# EAGLE design Adafruit PowerBoost 1000C (EAGLE 9.3.0)
COMPANY: ADAFRUIT INDUSTRIES; DRAWN: KTOWN; REV: A
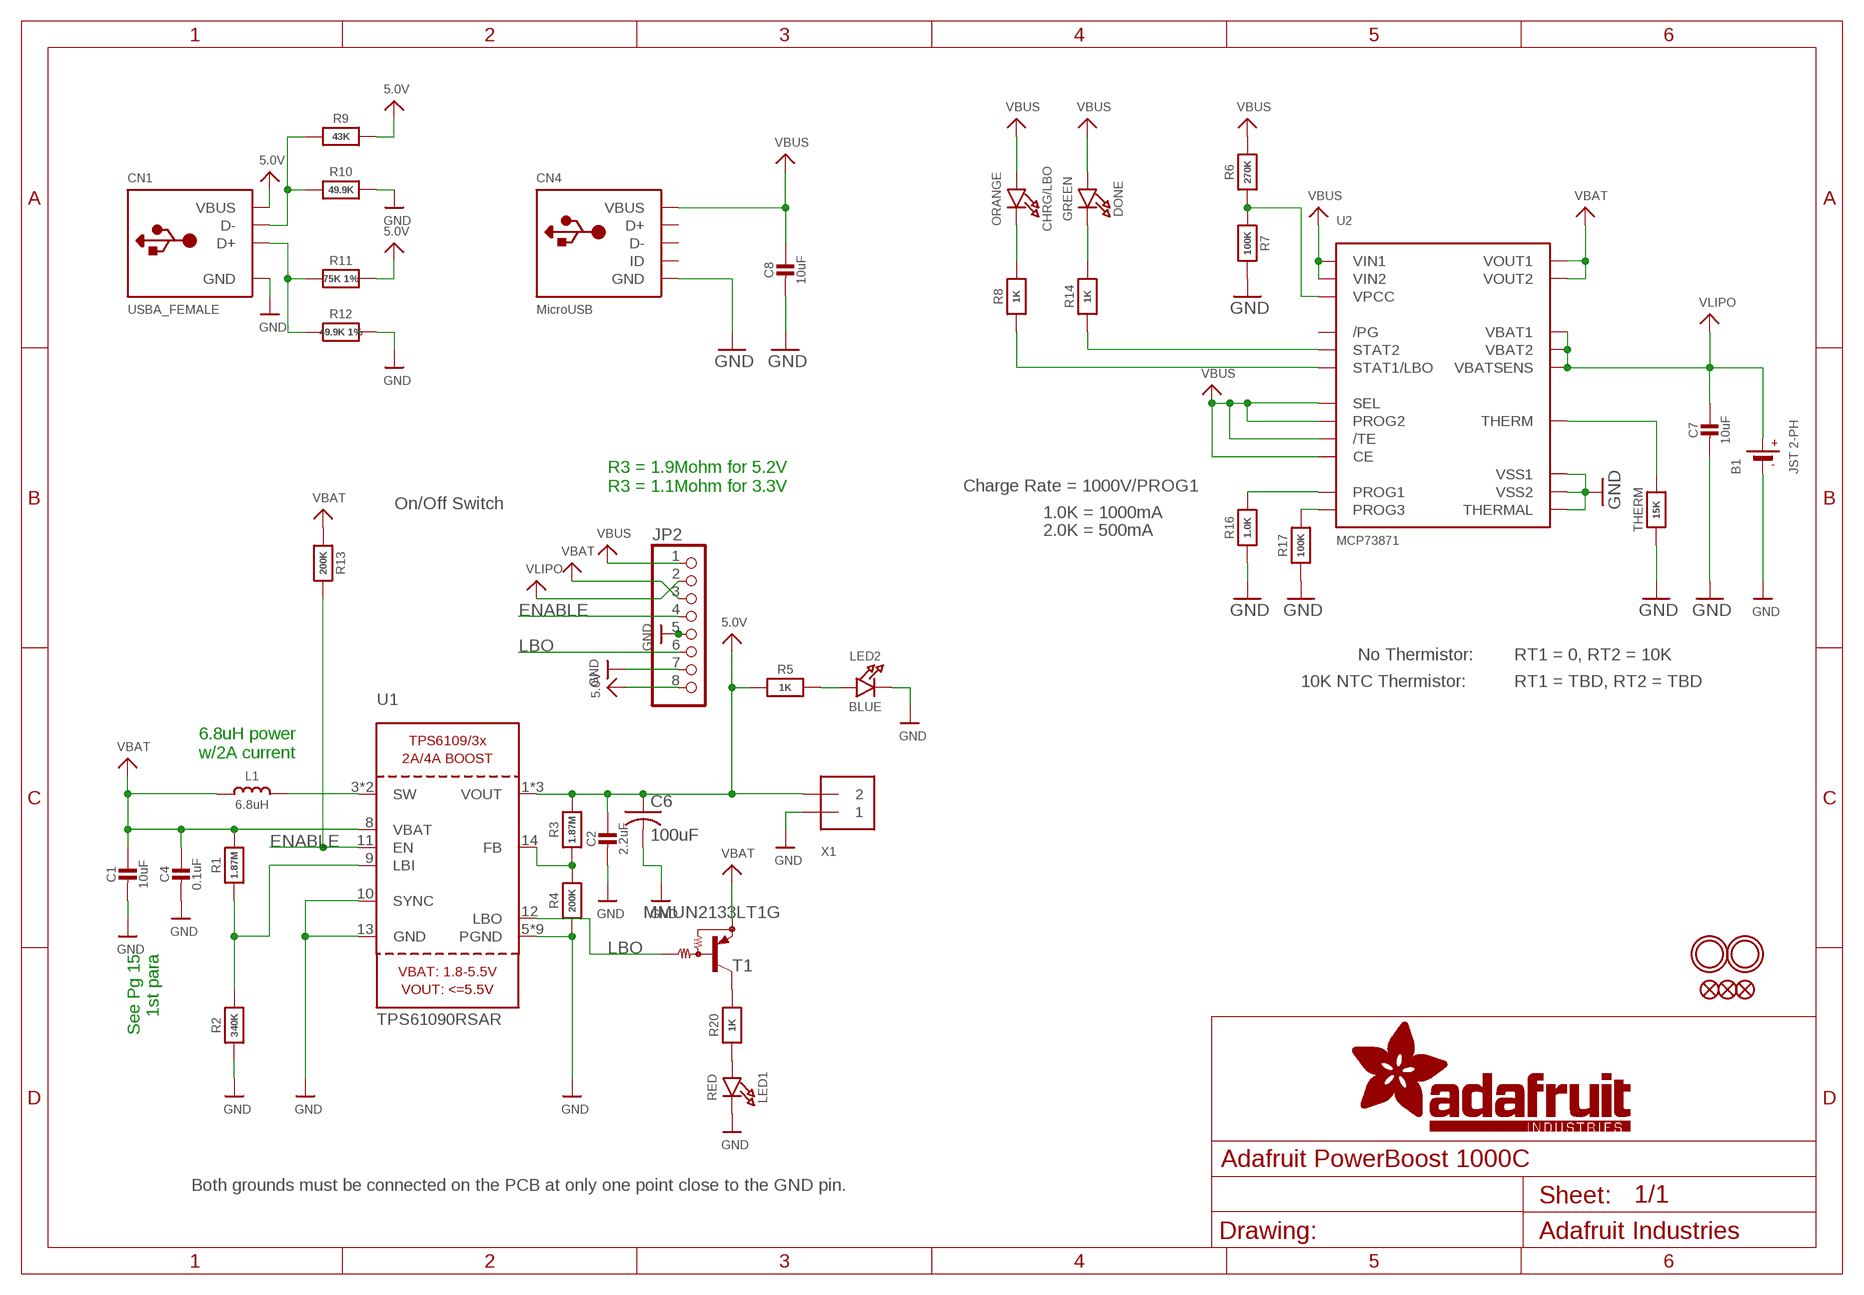
[diagram p0: schematic, sheet 1]

## Parts
B1  JST 2-PH  BATTERY  [JSTPH2]
C1  10uF  CAP_CERAMIC0805-NOOUTLINE  [0805-NO]
C2  2.2uF  CAP_CERAMIC0805-NOOUTLINE  [0805-NO]
C4  0.1uF  CAP_CERAMIC0805_10MGAP  [0805_10MGAP]
C6  100uF  C-USC1210  [C1210]
C7  10uF  CAP_CERAMIC0805-NOOUTLINE  [0805-NO]
C8  10uF  CAP_CERAMIC0805-NOOUTLINE  [0805-NO]
CHRG/LBO  ORANGE  LED0805_NOOUTLINE  [CHIPLED_0805_NOOUTLINE]
CN1  USBA_FEMALE  USB_TYPEAPTHFML  [USB_HOST-PTH]
CN4  MicroUSB  USBMICRO_20329  [4UCONN_20329]
DONE  GREEN  LED0805_NOOUTLINE  [CHIPLED_0805_NOOUTLINE]
FID1  FIDUCIAL""  [FIDUCIAL_1MM]
FID2  FIDUCIAL""  [FIDUCIAL_1MM]
FID3  FIDUCIAL""  [FIDUCIAL_1MM]
JP2  HEADER-1X8ROUND  [1X08_ROUND]
L1  6.8uH  INDUCTORTDK_VLC5045  [INDUCTOR_5X5MM_TDK_VLC5045]
LED1  RED  LED0805_NOOUTLINE  [CHIPLED_0805_NOOUTLINE]
LED2  BLUE  LED0805_NOOUTLINE  [CHIPLED_0805_NOOUTLINE]
R1  1.87M  RESISTOR_0805MP  [_0805MP]
R2  340K  RESISTOR_0805MP  [_0805MP]
R3  1.87M  RESISTOR0805_NOOUTLINE  [0805-NO]
R4  200K  RESISTOR0805_NOOUTLINE  [0805-NO]
R5  1K  RESISTOR0805_NOOUTLINE  [0805-NO]
R6  270K  RESISTOR0805_NOOUTLINE  [0805-NO]
R7  100K  RESISTOR0805_NOOUTLINE  [0805-NO]
R8  1K  RESISTOR0805_NOOUTLINE  [0805-NO]
R9  43K  RESISTOR0805_NOOUTLINE  [0805-NO]
R10  49.9K  RESISTOR0805_NOOUTLINE  [0805-NO]
R11  75K 1%  RESISTOR0805_NOOUTLINE  [0805-NO]
R12  49.9K 1%  RESISTOR0805_NOOUTLINE  [0805-NO]
R13  200K  RESISTOR0805_NOOUTLINE  [0805-NO]
R14  1K  RESISTOR0805_NOOUTLINE  [0805-NO]
R16  1.0K  RESISTOR0805_NOOUTLINE  [0805-NO]
R17  100K  RESISTOR0805_NOOUTLINE  [0805-NO]
R20  1K  RESISTOR0805_NOOUTLINE  [0805-NO]
T1  MMUN2133LT1G  MUN2114T1-PNP_DRIVER-SC59-BEC  [SC59-BEC]
THERM  15K  RESISTOR0805_NOOUTLINE  [0805-NO]
U1  TPS61090RSAR  VREG_TPS6103X  [PVQFN-16]
U2  MCP73871  [QFN20_4MM]
U$10  MOUNTINGHOLE2.5  [MOUNTINGHOLE_2.5_PLATED]
U$11  MOUNTINGHOLE2.5  [MOUNTINGHOLE_2.5_PLATED]
X1  TERMBLOCK_1X2  [TERMBLOCK_1X2-3.5MM]

## Nets
5.0V: C2.1 C6.1 CN1.VBUS JP2.8 R3.2 R5.1 R9.2 R11.2 U1.1(VOUT) U1.15(VOUT) U1.16(VOUT) X1.2
D+: CN1.D+ R11.1 R12.1
D-: CN1.D- R9.1 R10.1
ENABLE: JP2.4 R13.2 U1.11(EN)
GND: B1.1(-) C1.2 C2.2 C4.2 C6.2 C7.2 C8.2 CN1.GND CN4.BASE@1(GND) CN4.BASE@2(GND) CN4.GND CN4.SPRT@1(GND) CN4.SPRT@2(GND) CN4.SPRT@3(GND) CN4.SPRT@4(GND) JP2.5 JP2.7 LED1.C LED2.C R2.1 R4.1 R7.2 R10.2 R12.2 R16.1 R17.1 THERM.1 U1.5(PGND) U1.6(PGND) U1.7(PGND) U1.10(SYNC) U1.13(GND) U1.P$18(PGND) U1.P$19(PGND) U1.P$20(PGND) U1.P$21(PGND) U1.P$22(PGND) U1.THERMAL(PGND) U2.P$10(VSS1) U2.P$11(VSS2) U2.P$21(THERMAL) X1.1
LBO: JP2.6 T1.B U1.12(LBO)
N$1: L1.P$2 U1.3(SW) U1.4(SW)
N$2: LED1.A R20.1
N$3: R1.1 R2.2 U1.9(LBI)
N$4: LED2.A R5.2
N$5: R3.1 R4.2 U1.14(FB)
N$6: R20.2 T1.C
N$7: R6.1 R7.1 U2.P$2(VPCC)
N$8: DONE.C R14.2
N$9: R14.1 U2.P$7(STAT2)
N$10: THERM.2 U2.P$5(THERM)
N$11: R8.1 U2.P$8(STAT1/LBO)
N$12: CHRG/LBO.C R8.2
N$13: R17.2 U2.P$12(PROG3)
N$16: R16.2 U2.P$13(PROG1)
VBAT: C1.1 C4.1 JP2.3 L1.P$1 R1.2 R13.1 T1.E U1.8(VBAT) U2.P$1(VOUT1) U2.P$20(VOUT2)
VBUS: C8.1 CHRG/LBO.A CN4.VBUS DONE.A JP2.1 R6.2 U2.P$3(SEL) U2.P$4(PROG2) U2.P$9(/TE) U2.P$17(CE) U2.P$18(VIN1) U2.P$19(VIN2)
VLIPO: B1.2(+) C7.1 JP2.2 U2.P$14(VBAT1) U2.P$15(VBAT2) U2.P$16(VBATSENS)
Unconnected: CN4.D+ CN4.D- CN4.ID U2.P$6(/PG)

## Notes on the sheet
- R3 = 1.9Mohm for 5.2V
  R3 = 1.1Mohm for 3.3V
- Charge Rate = 1000V/PROG1
- On/Off Switch
- 1.0K = 1000mA
- 2.0K = 500mA
- No Thermistor: | RT1 = 0, RT2 = 10K
- 10K NTC Thermistor: | RT1 = TBD, RT2 = TBD
- 6.8uH power
  w/2A current
- See Pg 15
  1st para
- Both grounds must be connected on the PCB at only one point close to the GND pin.

## Library data of the parts
B1 = microbuilder:BATTERY: CR1220 SMT - Digikey: 3001K-ND CD2032 BAT-HLD-001 - Digikey: BAT-HLD-001-ND
C1 C2 C4 C7 C8 = microbuilder:CAP_CERAMIC: Ceramic Capacitors For new designs, use the packages preceded by an '_' character since they are more reliable: The following footprints should be used on most boards: _0402 - Standard footprint for regular board layouts _0603 - Standard footprint for regular board layouts _0805 - Standard footprint for regular board layouts _1206 - Standard footprint for regular board layouts For extremely tight-pitch boards where space is at a premium, the following 'micro-pitch' footprints can be used (smaller pads, no silkscreen outline, etc.): _0402MP - Micro-pitch footprint for very dense/compact boards _0603MP - Micro-pitch footprint for very dense/compact boards _0805MP - Micro-pitch footprint for very dense/compact boards _1206MP - Micro-pitch footprint for very dense/compact boards
C6 = rcl:C-US: CAPACITOR, American symbol
CHRG/LBO DONE LED1 LED2 = microbuilder:LED: LED 0603 - 0603 Surface Mount Package 2mA: Green LED - Low Power (3.9mcd, 2ma, 1.7Vf) - Digikey: 475-2709-2-ND Orange LED - Low Power (9.8mcd, 2ma, 1.8Vf) - Digikey: 475-1194-2-ND Red LED - Low Power (5mcd, 2ma, 1.8Vf) - Digikey: 475-1195-2-ND Yellow LED - Low Power (7mcd, 2ma, 1.8Vf) - Digikey: 475-1196-2-ND 5mA: Blue LED - Low Power (17mcd, 5ma, 2.9Vf) - Digikey: LNJ937W8CRACT-ND 0805 - 0805 Surface Mount Package 2mA: Red LED (8.8mcd, 2mA, 1.8Vf, Clear) - Low Power [Digikey: 475-2510-1-ND] Green LED (5mcd, 2mA, 1.8Vf, Clear) - Low Power [Digikey: 475-2730-1-ND] Yellow LED (11.3mcd, 2mA, 1.8Vf, Clear) - Low Power [Digikey: 475-2555-1-ND] 20mA: Red LED (104mcd, 20mA, Diffused) - LS R976 [Digikey: 475-1278-6-ND] Red LED (12mcd, 20mA, 2.0Vf, Clear) - APT2012EC [Digikey: 754-1128-1-ND] Green LED (15mcd, 20mA, 2.2Vf, Clear) - APT2012GC [Digikey: 754-1131-1-ND] Orange LED (160mcd, 20mA, 2.1Vf, Clear) - APT2012SECK [Digikey: 754-1130-1-ND] 1206 - 1206 Surface Mount Package Green LED (26mcd, 20mA, Diffused) - LG N971 [Digikey: 475-1407-6-ND] Red LED (15mcd, 20mA, Diffused) - LH N974 [Digikey: 475-1416-6-ND] Cree - Cree High-Power Surface Mount LEDs XPEBWT-L1-0000-00D50 - White 111lm 350mA 2.9Vf 6200K 110° XTEAWT-00-0000-00000LEE3 - White 114lm 350mA 2.85Vf 5000K 115° Everlight - Everlight 45-21 Series Surface Mount LEDs 45-21/QK2C-B2832AC2CB2/2T - Warm White 2000mcd 20mA 3.25Vf 3050K 120° 45-21/LK2C-B38452C4CB2/2T - Nuetral White 2000mcd 20mA 3.25Vf 4150K 120° 45-21/LK2C-B50634C6CB2/2T - Cold White 2200mcd 20mA 3.25Vf 5650K 120° PLCC2 Reverse Mount LS T77K-J1L2-1-0-2-R18-Z - Red 11.25mcd 2mA 1.8Vf 630nm 120° LO T77K-L1M2-24-Z - Orange 19.6mcd 2mA 1.8Vf 606nm 120° LY T77K-K2M1-26-Z - Yellow 15.7mcd 2mA 1.8Vf 587nm 120°
CN1 = microbuilder:USB_TYPEA: USB - Type A Connectors Male types stick out and are inserted into a PC or matching females parts (these are the connectors used on USB Memory Sticks, etc.). Female parts are generally used for USB Host and accept a male-type connector. SMT - 4UCON: 10017 PTHFML - Digikey: 609-1045-ND, 4UCon: 05241 PCB - Use 2.0mm thick PCBs with this footprint
CN4 = microbuilder:USB: USB Connectors USBMINIB - Surface Mount Female Mini-B USB Connector 4UConnector: 06564
FID1-FID3 = microbuilder:FIDUCIAL: Fiducial Alignment Points Various fiducial points for machine vision alignment.; BOM: EXCLUDE
JP2 = microbuilder:HEADER-1X8: PIN HEADER
L1 = microbuilder:INDUCTOR: Inductors 0603: 10nH Ceramic Inductor - microwire antenna/RF (Digikey: 712-1434-2-ND) 0805: 560nH Ceramic Inductor - RF (Digikey: 553-1047-1-ND) 270nH Ceramic Inductor - Q = 40@250MHz, +-5%, 1 Ohm DC Resistance (Digikey: 535-10506-2-ND) 1007 (2518 Metric) SMT: 10µH 10% 250mOhm 820mA 1007 Inductor (Digikey: 587-2189-1-ND) 22µH 10% 500mOhm 580mA 1007 Inductor (Digikey: 587-2190-1-ND) 47µH 10% 950mOhm 420mA 1007 Inductor (Digikey: 587-2191-1-ND) 47µH 5% 100mOhm 1A 1008 Inductor (Digikey: 732-1816-1-ND) 5.0x5.0mm (Taiyo Yuden NR5040 Series) 6.8µH 20% 2.3A 64mOhm Inductor (Digikey: 587-2374-2-ND) 5.0x5.0mm (TDK VLC5045 Series) 4.7µH 20% 3.3A 34mOhm Inductor (Digikey: 445-6526-1-ND) 6.8µH 20% 2.7A 46mOhm Inductor (Digikey: 445-6527-1-ND) 6.0x6.0mm (TDK VLC6045 Series) 4.7µH 20% 3.8A 27mOhm Inductor (Digikey: 445-6538-2-ND) 6.8µH 20% 3A 41mOhm Inductor (Digikey: 445-6540-1-ND) 6.2µH 30% 2.2A 45mOhm Inductor (Digikey: SRR5028-6R2YCT-ND) - Not TDK VLC6045 but footprint should match 6.0x6.0mm (TDK SLF6045 Series) 6.8uH 30% 2A 33mOhm Inductor (Digikey: 445-4572-1-ND, Mouser: 810-SLF645T6R8N2R0PF) 6.0x6.0mm (Sumida CDRH5D28 Series) 6.2uH 30% 1.8A 45mOhm Inductor (Digikey: 308-1542-1-ND) Taiyo Yuden NR3015T2R2M - 2.2uH 20% 1.5A (Digikey: 587-1648-2-ND, Mouser: 963-NR3015T2R2M) - Used with TI TPS62172 CoilCraft RFID Transponder Coil - MA5532-AE (For use with AS3935 Lightning Sensor) Vishay IHLP 1.0uH Molded Inductor - 24mOhm DCR, 5A, +/-20%, -55°C-125°C (Digikey: 541-1319-1-ND)
R1-R14 R16 R17 R20 THERM = microbuilder:RESISTOR: Resistors For new designs, use the packages preceded by an '_' character since they are more reliable: The following footprints should be used on most boards: _0402 - Standard footprint for regular board layouts _0603 - Standard footprint for regular board layouts _0805 - Standard footprint for regular board layouts _1206 - Standard footprint for regular board layouts For extremely tight-pitch boards where space is at a premium, the following 'micro-pitch' footprints can be used (smaller pads, no silkscreen outline, etc.): _0402MP - Micro-pitch footprint for very dense/compact boards _0603MP - Micro-pitch footprint for very dense/compact boards _0805MP - Micro-pitch footprint for very dense/compact boards _1206MP - Micro-pitch footprint for very dense/compact boards
T1 = transistor:*-PNP_DRIVER-: PNP Bias Resistor Transistor
U1 = microbuilder:VREG_TPS6103X: TPS6103x 4A Boost - 1.8-5.5V Input, Adjustable Output to 5.5V
U2 = microbuilder:MCP73871: MCP73871 Lithium Polymer Battery Charger Digikey: MCP73871-2CCI/ML-ND
U$10 U$11 = microbuilder:MOUNTINGHOLE: Mounting Hole For #2 screws (0.086"/2.18mm width, 0.094"/2.4mm hole) use 2.5mm; BOM: EXCLUDE
X1 = microbuilder:TERMBLOCK_1X2: 3.5mm Terminal block http://www.ladyada.net/library/pcb/eaglelibrary.html

## Board
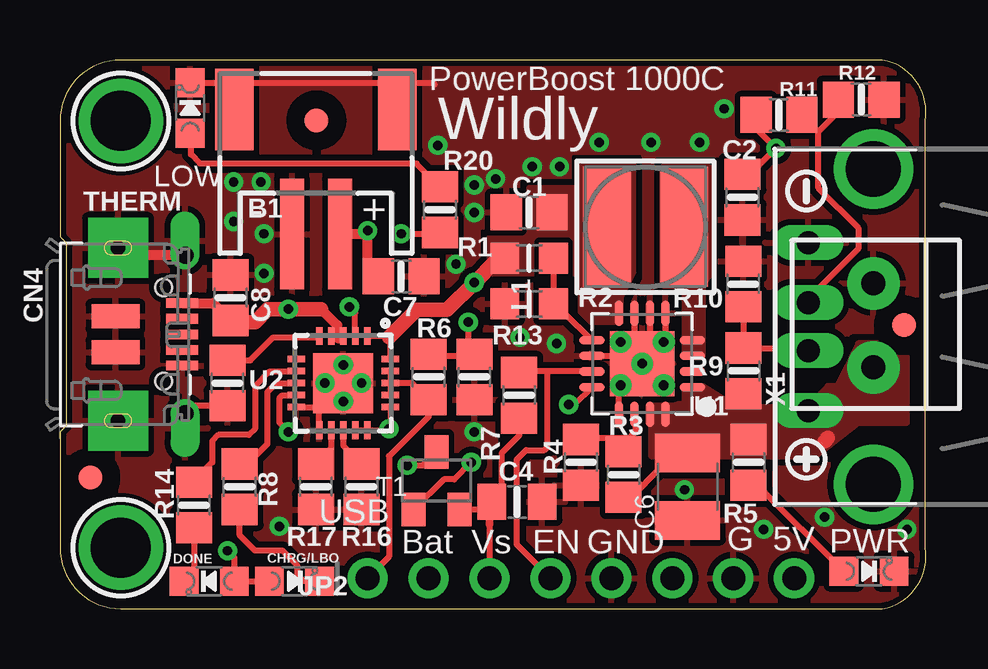
[diagram p1: board, top side]
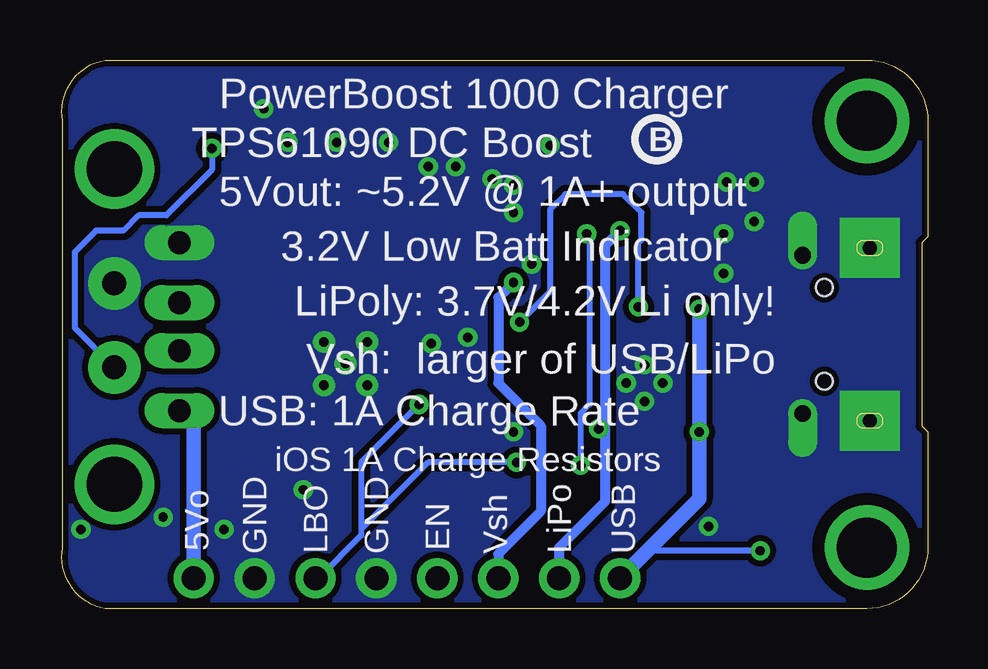
[diagram p2: board, bottom side, seen from below]

Size 36.1 x 22.86 mm. Coordinates in mm from the lower left corner, seen from the top.
Outline: 34.29,22.86 2.54,22.86 arc90 0,20.32 0,15.49 0.25,15.24 0.25,7.62 0,7.37 0,2.54 arc90 2.54,0 34.29,0 arc90 36.07,2.54 36.07,20.32 arc90 34.29,22.86
Copper layers (1*16): Top 0.035mm / dielectric 1.5mm / Bottom 0.035mm
Design rules "adafruit *": minimum track width 8mil, minimum drill 15.5mil, track to track 8mil, track to pad 8mil, pad to pad 8mil, via to via 8mil, smd to smd 8mil, copper to edge 10mil, drill to drill 8mil, minimum pad ring 10mil, minimum via ring 8mil, stop-mask expansion 2mil, vias tented up to drill 20mil, thermal gap 10mil
tRestrict: area 22.9,7.9 to 23.1,8.3; area 24.9,12.1 to 25,12.4; area 24.3,12.1 to 24.4,12.4

### Footprints (pad centres in the part's own frame; a part is rotated, then mirrored left to right if it is on the bottom)
JSTPH2 = smd 1 x 4.6: 1 -1,-3.7; 2 1,-3.7 | smd 1.6 x 3.4: NC1 -3.4,1.5; NC2 3.4,1.5
0805-NO = smd 1.3 x 1.5: 1 -0.95,0; 2 0.95,0
0805_10MGAP = smd 1.2 x 1.5: 1 -1.05,0; 2 1.05,0
C1210 = smd 1.6 x 2.7: 1 -1.4,0; 2 1.4,0
CHIPLED_0805_NOOUTLINE = smd 1.2 x 1.2: A 0,-1.05; C 0,1.05
USB_HOST-PTH = drill 0.95 long: D+ 1,6.52; D- -1,6.52; GND 3.5,6.52; VBUS -3.5,6.52 | drill 2.3 pad 2.9: S1 -6.57,3.81; S2 6.57,3.81
4UCONN_20329 = smd 1 x 2: BASE@1 -0.75,-2; BASE@2 0.75,-2 | smd 0.4 x 1.35: D+ 0,0.775; D- -0.65,0.775; GND 1.3,0.775; ID 0.65,0.775; VBUS -1.3,0.775 | drill 0.7 offset: SPRT@1 -3.3,0.9; SPRT@2 3.3,0.9 | drill 0.6 pad 2.5 square: SPRT@3 -3.6,-1.9; SPRT@4 3.6,-1.9 | hole 0.7: -1.95,0; 1.95,0
FIDUCIAL_1MM = smd 1 x 1: 1 0,0
1X08_ROUND = drill 1 pad 1.676: 1 -8.89,0; 2 -6.35,0; 3 -3.81,0; 4 -1.27,0; 5 1.27,0; 6 3.81,0; 7 6.35,0; 8 8.89,0
INDUCTOR_5X5MM_TDK_VLC5045 = smd 2 x 5: P$1 -1.6,0; P$2 1.6,0
_0805MP = smd 1.2 x 1.3: 1 -1.016,0; 2 1.016,0
SC59-BEC = smd 1 x 1.4: B -0.95,-1.2; C 0,1.2; E 0.95,-1.2
PVQFN-16 = smd 1.05 x 0.35: 1 -2.1,0.975; 2 -2.1,0.325; 3 -2.1,-0.325; 4 -2.1,-0.975; 9 2.1,-0.975; 10 2.1,-0.325; 11 2.1,0.325; 12 2.1,0.975 | smd 0.35 x 1.05: 5 -0.975,-2.1; 6 -0.325,-2.1; 7 0.325,-2.1; 8 0.975,-2.1; 13 0.975,2.1; 14 0.325,2.1; 15 -0.325,2.1; 16 -0.975,2.1 | drill 0.4: P$18 0,0; P$19 -0.9,0.9; P$20 0.9,0.9; P$21 0.9,-0.9; P$22 -0.9,-0.9 | smd 2.7 x 2.7: THERMAL 0,0
QFN20_4MM = smd 0.73 x 0.28: P$1 -1.965,1; P$2 -1.965,0.5; P$3 -1.965,0; P$4 -1.965,-0.5; P$5 -1.965,-1; P$11 1.965,-1; P$12 1.965,-0.5; P$13 1.965,0; P$14 1.965,0.5; P$15 1.965,1 | smd 0.28 x 0.73: P$6 -1,-1.965; P$7 -0.5,-1.965; P$8 0,-1.965; P$9 0.5,-1.965; P$10 1,-1.965; P$16 1,1.965; P$17 0.5,1.965; P$18 0,1.965; P$19 -0.5,1.965; P$20 -1,1.965 | smd 2.5 x 2.5: P$21 0,0
MOUNTINGHOLE_2.5_PLATED = drill 2.5 pad 3.2: P$1 0,0
TERMBLOCK_1X2-3.5MM = drill 1 pad 2.184: 1 1.8,0; 2 -1.7,0

### Placement (x,y rotation side)
B1  10.67,19.3 0 top
C1  19.56,16.51 180 top
C2  28.45,17.14 270 top
C4  19.05,4.45 0 top
C6  26.16,5.08 270 top
C7  14.22,13.84 0 top
C8  7.11,12.95 90 top
CHRG/LBO  9.78,1.14 270 top
CN1  37.72,11.75 90 top
CN4  4.32,11.43 270 top
DONE  6.22,1.14 90 top
FID1  35.18,11.81 0 top
FID2  10.69,20.34 90 top
FID3  1.27,5.46 0 top
JP2  21.72,1.27 0 top
L1  24.4,15.9 0 top
LED1  5.43,20.86 0 top
LED2  33.72,1.56 270 top
R1  19.56,14.61 180 top
R2  19.56,12.7 0 top
R3  23.5,5.59 270 top
R4  21.72,6.1 90 top
R5  28.7,6.1 270 top
R6  15.37,9.65 270 top
R7  17.27,9.65 270 top
R8  7.49,5.08 270 top
R9  28.5,9.91 270 top
R10  28.48,13.52 90 top
R11  29.97,20.57 180 top
R12  33.4,21.21 0 top
R13  19.14,8.89 90 top
R14  5.59,4.32 270 top
R16  12.57,5.08 90 top
R17  10.67,5.08 90 top
R20  15.84,16.62 270 top
T1  15.7,5.33 0 top
THERM  6.99,9.4 90 top
U1  24.27,10.21 180 top
U2  11.81,9.4 270 top
U$10  2.54,20.32 0 top
U$11  2.54,2.54 0 top
U$12  [PCBFEAT-REV-040]  11.3,19.56 0 bottom
U$25  [SYMBOL_PLUS]  31.11,6.22 0 top
U$26  [SYMBOL_MINUS]  31.11,17.4 90 top
X1  33.91,11.75 90 top

### Tracks (layer width: path | path; a pad name or v marks a point on that pad's centre or on a via)
5.0V  (via drill 0.39)
  Top 0.254: 32.38,8.38 32.13,8.38 32,8.25 CN1.VBUS | R11.2 29.02,20 v29.84,19.18 28.76,18.09 C2.1 | R3.2 23.82,4.64 25.02,5.84 25.52,5.84 C6.1
  Top 0.61: 31.88,6.99 32,7.11
  Bottom 0.254: v29.84,19.18 29.84,18.29 31.75,16.38 32.89,16.38 33.53,15.75 34.67,15.75 35.56,14.86 35.56,11.7 X1.2
  Bottom 0.61: JP2.8 30.61,7.66 CN1.VBUS
  pour Top (isolate 0.254, no thermals): 24.64,8.51 24.64,6.35 31.5,6.35 33.27,7.75 35.31,7.75 35.31,11.05 33.27,11.05 32.38,9.27 32,9.27 31.11,8.38 28.19,8.38 26.8,9.27 26.04,9.27 26.04,8.51
D+
  Top 0.254: CN1.D+ 31.2,12.91 33.27,14.99 33.27,15.88 31.62,17.53 31.62,19.87 | 31.62,19.87 R11.1 | R12.1 32.45,20.7 31.62,19.87
D-
  Top 0.254: R10.1 28.48,10.88 R9.1 31.09,10.86 CN1.D-
ENABLE
  Top 0.254: U1.11 20.32,9.88 | 20.32,9.88 19.19,9.88 R13.2 | JP2.4 19.05,2.67 19.05,6.22 19.43,6.6 20.19,6.6 20.32,6.73 20.32,9.88
GND  (via drill 0.39)
  Top 0.254: U1.13 23.3,9.07 23.5,9.27 23.41,9.27 U1.P$20 | U1.10 23.61,10.53 23.62,10.54 23.37,10.79 U1.P$21 23.44,11.18 23.88,11.18 23.95,11.25 U1.7 | U1.6 24.6,10.96 24.77,10.79 | U1.5 25.25,11.18 U1.P$22 | THERM.1 5.54,8.45 CN4.SPRT@2 5.22,8.26 5.33,8.26 | LED1.C 15.55,21.91 15.62,21.84 | U2.P$11 10.81,9.16 v11.05,9.4 | U2.P$10 11.57,8.4 v11.81,8.64
  Top 0.406: CN4.SPRT@1 2.85,14.73 | 4.91,7.83 5.33,8.26
  other vias: 27.69,20.83 26.04,4.95 29.34,3.3 31.88,3.81 35.31,3.3 19.18,11.3 17.27,7.37 11.81,10.16 9.14,3.43 20.7,11.05 12.57,9.4 16.51,14.35 19.68,18.41 20.83,18.41 15.75,19.3 17.27,16.51 18.16,17.91 17.27,17.65 8.51,15.62 8.51,13.97 8.38,17.78 7.24,17.78 7.24,16.13 26.67,19.43 24.64,19.43 22.48,19.43
  pour Top (isolate 0.254, rank 2): 0,0.12 0,22.86 36.07,22.99 36.07,0.25
  pour Bottom (isolate 0.254, no thermals): 0,22.73 36.07,22.99 36.07,0.25 0,0
LBO  (via drill 0.39)
  Top 0.254: U1.12 21.45,8.51 v21.21,8.51 | v17.14,6.1 16.44,5.39 16,5.39 T1.B
  Bottom 0.254: v21.21,8.51 23.62,6.1 23.62,3.3 | 23.62,3.3 23.62,3.05 25.4,1.27 JP2.6 | v17.14,6.1 20.83,6.1 23.62,3.3
N$1
  pour Top (isolate 0.254, no thermals): 26.04,10.54 26.8,10.54 26.8,13.46 27.05,13.84 27.05,18.41 25.15,18.41 25.15,13.46 26.04,13.46
N$2
  Top 0.254: R20.1 14.87,18.54 5.84,18.54 5.46,18.92 5.46,19.78 LED1.A
N$3
  Top 0.254: R1.1 R2.2 20.94,12.34 21.02,12.34 U1.9
N$4
  Top 0.254: R5.2 29.08,5.15 LED2.A
N$5
  Top 0.254: 23.75,7.11 24,7.37 24,8.05 U1.14 | R4.2 21.72,7.11 23.75,7.11 | R3.1 23.5,6.86 23.75,7.11
N$6  (via drill 0.39)
  Top 0.254: v14.48,5.97 15.13,5.97 T1.C | v14.22,15.62 15.79,15.62 R20.2
  Bottom 0.254: v14.22,15.62 14.1,15.49 14.1,8.51 14.48,8.13 v14.48,5.97
N$7  (via drill 0.39)
  Top 0.254: R6.1 15.43,10.6 15.49,10.54 17.21,10.54 R7.1 | R7.1 17.33,10.54 | U2.P$2 12.31,12.33 v12.06,12.57 | v17.02,11.94 17.02,10.86 R7.1
  Bottom 0.254: v12.06,12.57 12.06,15.24 11.94,15.37 11.94,16.51 12.7,17.27 15.11,17.27 15.75,16.64 15.75,13.21 v17.02,11.94
N$8
  Top 0.254: R14.2 5.59,1.56 DONE.C
N$9
  Top 0.254: R14.1 5.59,5.33 6.35,6.1 6.35,6.99 6.6,7.24 7.87,7.24 8.13,7.49 8.13,9.27 8.74,9.88 9.83,9.88 U2.P$7
N$10
  Top 0.254: THERM.2 7.93,10.35 8.89,11.3 10.82,11.3 U2.P$5
N$11
  Top 0.254: R8.1 7.69,6.22 8,6.22 8.64,6.86 8.64,9.02 9,9.38 9.83,9.38 U2.P$8
N$12
  Top 0.254: CHRG/LBO.C 10.16,1.14 9.91,1.4 9.91,1.78 9.27,2.41 8.13,2.41 7.49,3.05 R8.2
N$13
  Top 0.254: U2.P$12 11.31,6.67 R17.2
N$16
  Top 0.254: U2.P$13 11.81,6.79 R16.2
VBAT  (via drill 0.39)
  Top 0.254: R13.1 19.14,7.21 18.41,6.48 18.41,4.86 C4.1 17.69,4.13 T1.E | 17.91,3.49 JP2.3 | U2.P$1 13.66,11.36 13.72,11.3 13.83,11.19 13.78,11.14 U2.P$20
  Top 0.305: 17.91,3.49 17.91,4.35 C4.1
  Top 0.61: 13.72,11.3 14.86,12.45 16.13,12.45 v17.27,13.59 18.16,14.48 18.54,14.48 R1.2
  Bottom 0.406: v17.27,13.59 17.91,12.95 17.91,9.4 16.13,7.62 16.13,4.06 17.91,2.29 JP2.3
  pour Top (isolate 0.254, no thermals): 23.37,11.94 21.72,11.94 21.72,18.54 23.88,18.54 23.88,13.97 23.37,12.95
  pour Top (no thermals): 19.56,17.53 19.56,15.49 17.91,15.49 17.91,13.97 21.59,13.97 21.72,17.53
VBUS  (via drill 0.39)
  Top 0.254: v9.53,7.37 9.14,7.75 9.14,8.76 9.27,8.88 9.83,8.88 U2.P$9 | CHRG/LBO.A DONE.A 7.27,2.12 v6.99,2.41 | JP2.1 13.72,2.16 13.72,6.35 15.37,8 R6.2 14.68,9.38 13.79,9.38 U2.P$18 | U2.P$4 U2.P$3 11.64,11.36 11.63,11.35 | U2.P$19 U2.P$18 | U2.P$18 U2.P$17
  Top 0.406: CN4.VBUS 6.39,12.73 C8.1 | 10.89,12.48 11.56,11.81 11.56,11.43 | 15.18,8.88 R6.2
  Top 0.61: 10.89,12.48 v9.53,12.48 8.67,12.48 8.13,11.94 7.18,11.94 C8.1 | 11.63,11.35 11.56,11.43
  Bottom 0.254: v6.99,2.41 11.68,2.41
  Bottom 0.61: v9.53,12.48 v9.53,7.37 9.53,4.57 11.68,2.41 JP2.1
VLIPO  (via drill 0.39)
  Top 0.254: U2.P$14 U2.P$15 13.66,7.43 v13.72,7.49 13.78,7.55 U2.P$16
  Top 0.406: B1.2 12.68,15.6 v12.83,15.75 12.83,14.29 C7.1
  Bottom 0.406: v13.72,7.49 13.46,7.49 | JP2.2 15.37,2.54 13.46,4.45 13.46,7.49 | v12.83,15.75 13.46,15.11 13.46,7.49

### Text on the board
tPlace: PowerBoost 1000C | Wildly | LOW | - | + | USB | PWR | Bat | Vs | EN | GND | G | 5V
bPlace: PowerBoost 1000 Charger | TPS61090 DC Boost | 5Vout: ~5.2V @ 1A+ output | 3.2V Low Batt Indicator | LiPoly: 3.7V/4.2V Li only! | Vsh: larger of USB/LiPo | USB: 1A Charge Rate | iOS 1A Charge Resistors | USB | LiPo | Vsh | EN | GND | LBO | GND | 5Vo